# Altium schematic sheet 6_Peripherals.SchDoc
size A3; Organization: Altium Limited; Address1: L3, 12a Rodborough Rd; Address2: Frenchs Forest; Address3: NSW; Address4: Australia 2086; SheetNumber: 6; SheetTotal: 7
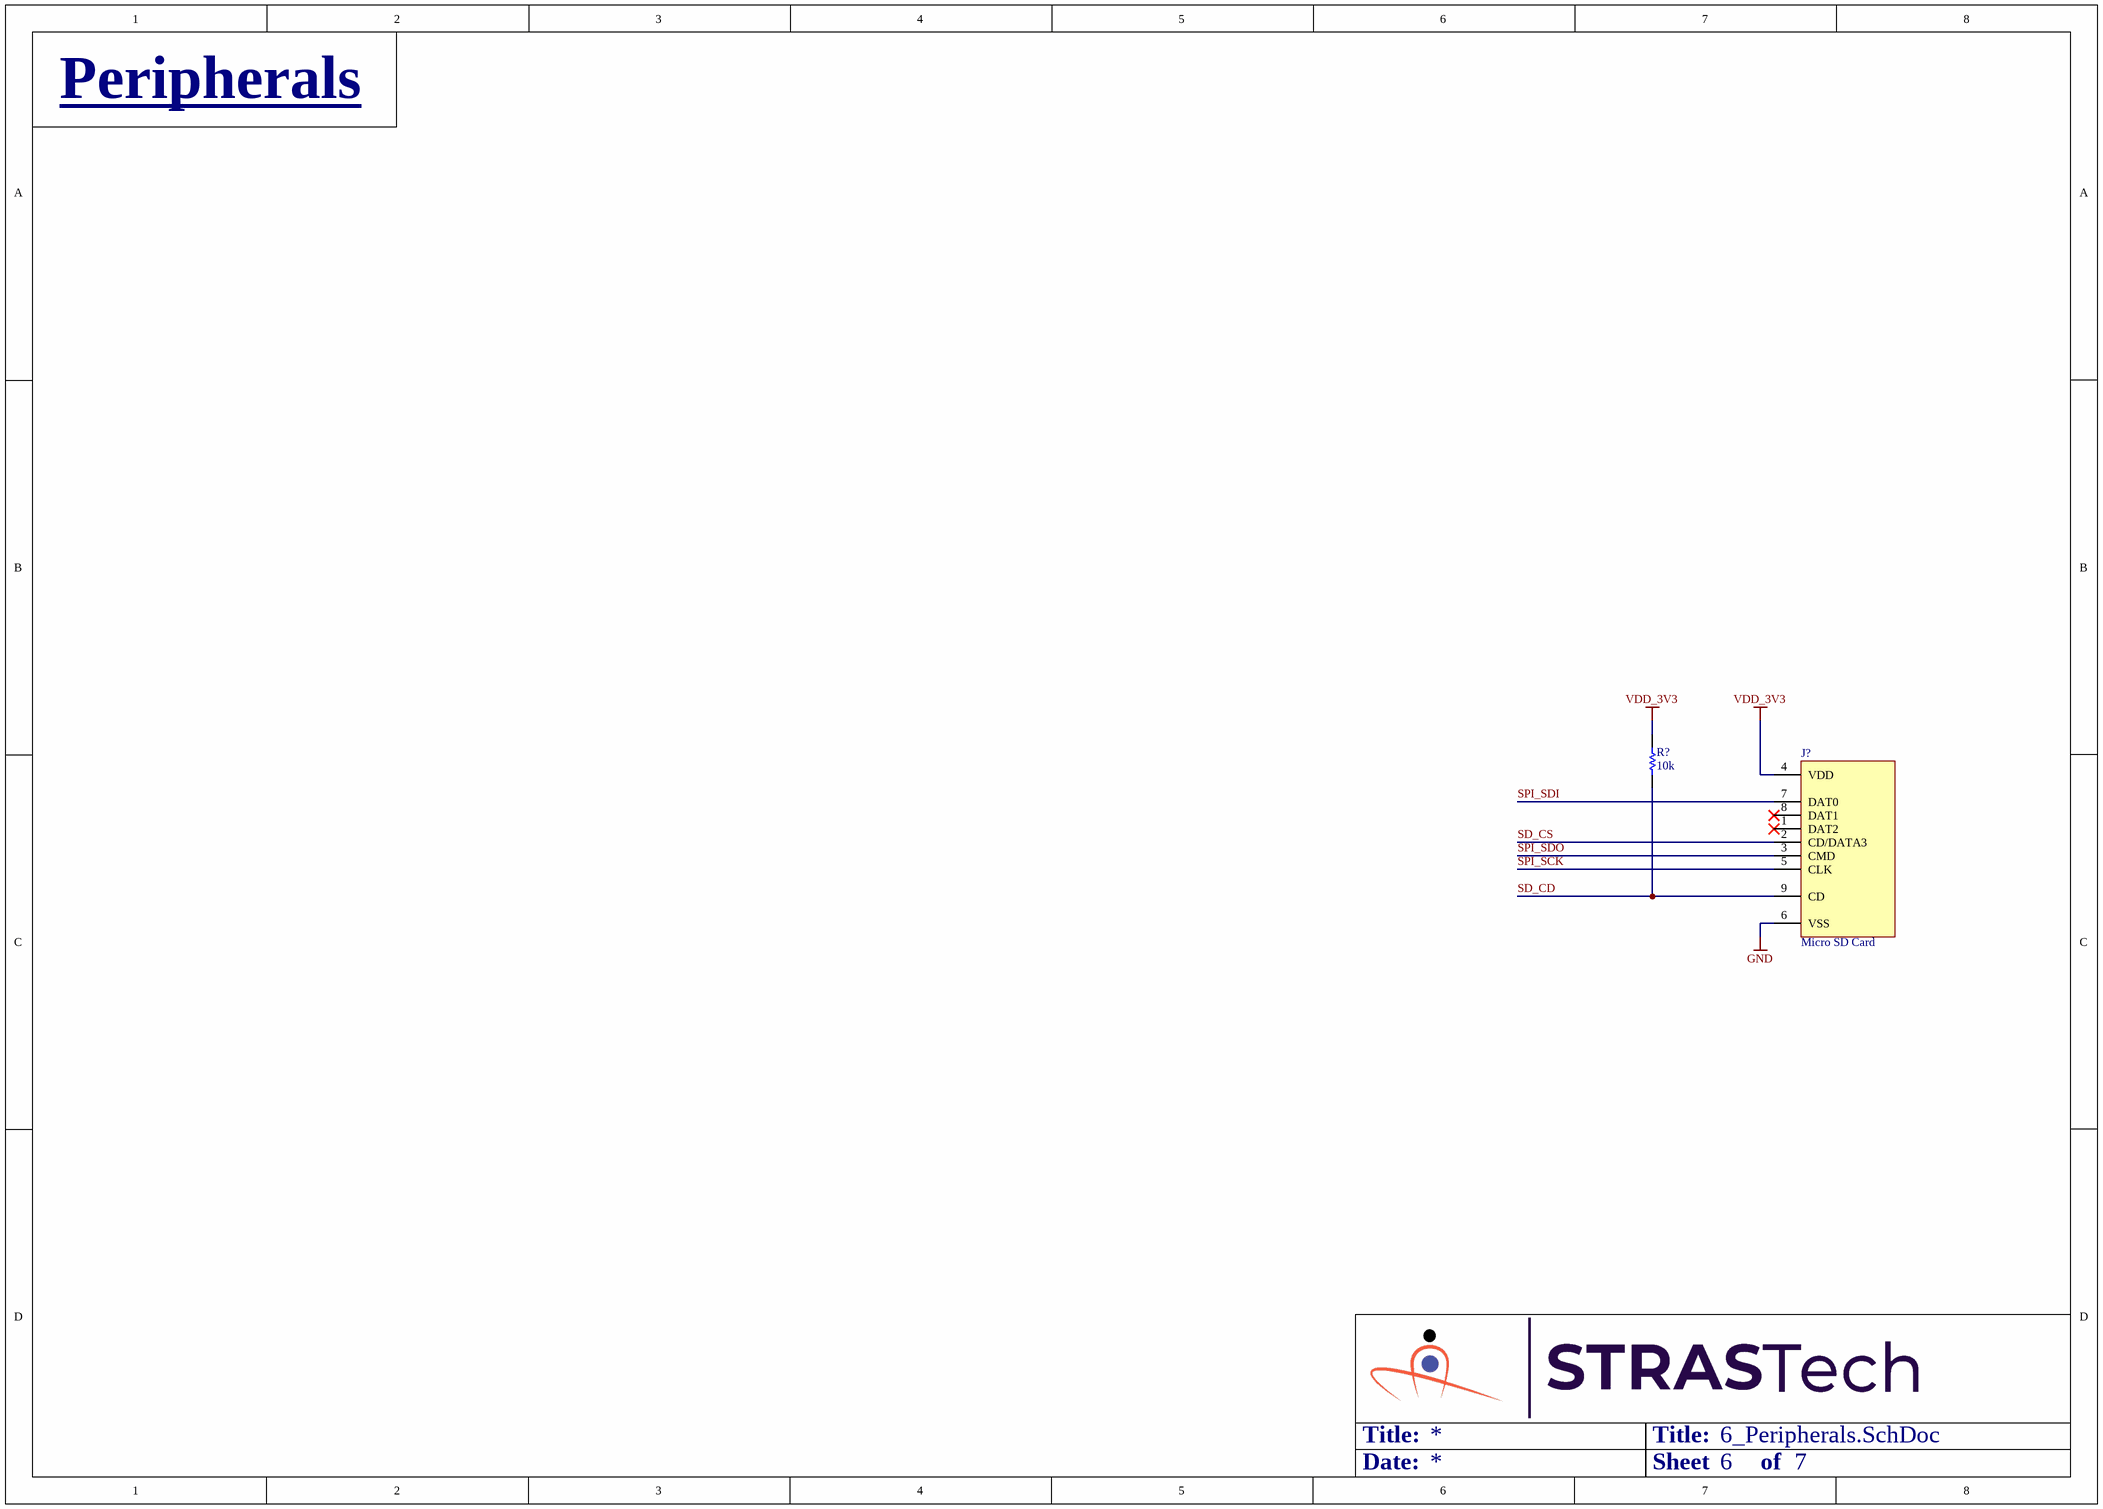
[diagram p0: 6_Peripherals.SchDoc]

## Parts
J?  Micro SD Card  [Conn,MicroSD,Push-Push,SMD]
R?  10k  [RES,0402]

## Nets
GND: J?.6(VSS)
VDD_3V3: J?.4(VDD) R?.2
SD_CD: J?.9(CD) R?.1
SD_CS: J?.2(CD/DATA3)
SPI_SCK: J?.5(CLK)
SPI_SDI: J?.7(DAT0)
SPI_SDO: J?.3(CMD)

Not connected (* = marked no-connect by the designer): J? 1(DAT2)* 8(DAT1)*

## Notes on the sheet
- Peripherals
- Title:
- Date:
- Sheet
- of
- Title
- Size:
- A3
- Revision:
- Design By:

## Library data of the parts
J? = Conn,MicroSD,SMD,Push-Push: 9 (8 + 1) Position Card Connector Secure Digital - microSD™ Surface Mount, Right Angle Gold; Manufacturer: GCT; Manufacturer Part Number: MEM2075-00-140-01-A; Vendor Part Number: 2073-MEM2075-00-140-01-ACT-ND; Vendor: Digikey; CreatedBy: Judd Foster; HelpURL: https://gct.co/files/specs/MEM2075-SPEC.pdf
R? = RES,10k,5%,0.063W,0402: 10 kOhms ±5% 0.063W, 1/16W Chip Resistor 0402 (1005 Metric) Automotive AEC-Q200 Thick Film; Vendor Part Number: RMCF0402JT10K0CT-ND; Manufacturer: Stackpole Electronics Inc; Manufacturer Part Number: RMCF0402JT10K0; Vendor: DIgikey; HelpURL: https://www.seielect.com/catalog/sei-rmcf_rmcp.pdf; CreatedBy: Judd Foster